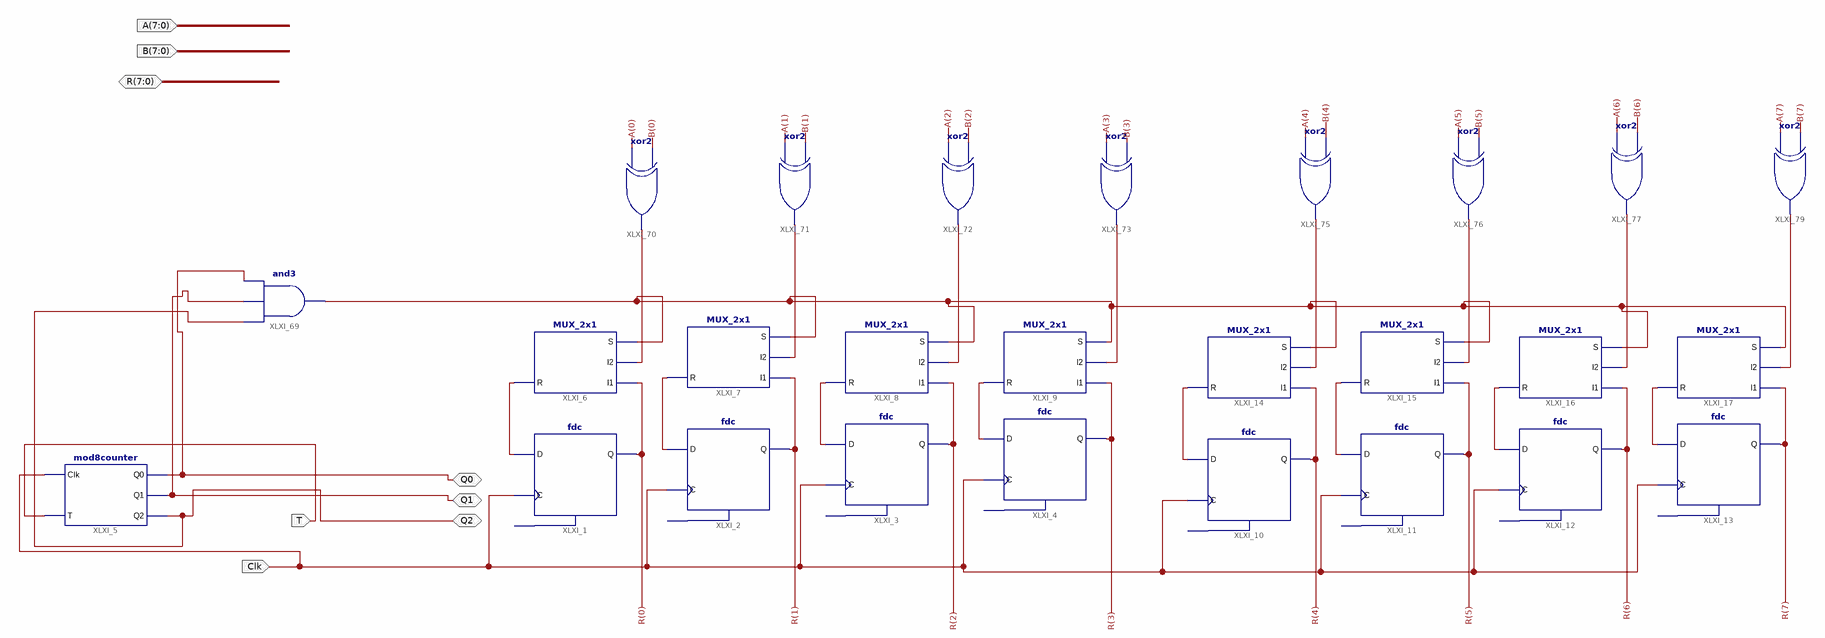
[diagram p0: schematic sheet 1]
// Xilinx ISE schematic first_g.sch (spartan3) as structural Verilog: 26 symbols, 8 ports
module first_g (
  input  T,
  input  Clk,
  input  [7:0] A,
  input  [7:0] B,
  inout  Q0,
  inout  Q2,
  inout  Q1,
  inout  [7:0] R
);

  wire XLXN_12, XLXN_13, XLXN_14, XLXN_15, XLXN_21, XLXN_22, XLXN_23, XLXN_24, XLXN_32, XLXN_33, XLXN_35,
       XLXN_37, XLXN_38, XLXN_39, XLXN_40, XLXN_41, XLXN_113;

  fdc XLXI_1 (.C(Clk), .D(XLXN_12), .Q(R[0]));  // open: CLR
  fdc XLXI_2 (.C(Clk), .D(XLXN_13), .Q(R[1]));  // open: CLR
  fdc XLXI_3 (.C(Clk), .D(XLXN_14), .Q(R[2]));  // open: CLR
  fdc XLXI_4 (.C(Clk), .D(XLXN_15), .Q(R[3]));  // open: CLR
  mod8counter XLXI_5 (.Clk(Clk), .T(T), .Q0(Q0), .Q1(Q1), .Q2(Q2));
  MUX_2x1 XLXI_6 (.I1(R[0]), .I2(XLXN_32), .S(XLXN_113), .R(XLXN_12));
  MUX_2x1 XLXI_7 (.I1(R[1]), .I2(XLXN_33), .S(XLXN_113), .R(XLXN_13));
  MUX_2x1 XLXI_8 (.I1(R[2]), .I2(XLXN_35), .S(XLXN_113), .R(XLXN_14));
  MUX_2x1 XLXI_9 (.I1(R[3]), .I2(XLXN_37), .S(XLXN_113), .R(XLXN_15));
  fdc XLXI_10 (.C(Clk), .D(XLXN_21), .Q(R[4]));  // open: CLR
  fdc XLXI_11 (.C(Clk), .D(XLXN_22), .Q(R[5]));  // open: CLR
  fdc XLXI_12 (.C(Clk), .D(XLXN_23), .Q(R[6]));  // open: CLR
  fdc XLXI_13 (.C(Clk), .D(XLXN_24), .Q(R[7]));  // open: CLR
  MUX_2x1 XLXI_14 (.I1(R[4]), .I2(XLXN_38), .S(XLXN_113), .R(XLXN_21));
  MUX_2x1 XLXI_15 (.I1(R[5]), .I2(XLXN_39), .S(XLXN_113), .R(XLXN_22));
  MUX_2x1 XLXI_16 (.I1(R[6]), .I2(XLXN_40), .S(XLXN_113), .R(XLXN_23));
  MUX_2x1 XLXI_17 (.I1(R[7]), .I2(XLXN_41), .S(XLXN_113), .R(XLXN_24));
  and XLXI_69 (XLXN_113, Q2, Q1, Q0);
  xor XLXI_70 (XLXN_32, A[0], B[0]);
  xor XLXI_71 (XLXN_33, A[1], B[1]);
  xor XLXI_72 (XLXN_35, A[2], B[2]);
  xor XLXI_73 (XLXN_37, A[3], B[3]);
  xor XLXI_75 (XLXN_38, A[4], B[4]);
  xor XLXI_76 (XLXN_39, A[5], B[5]);
  xor XLXI_77 (XLXN_40, A[6], B[6]);
  xor XLXI_79 (XLXN_41, A[7], B[7]);
endmodule
